# EAGLE schematic Tayloe Detector (EAGLE 9.1.2)
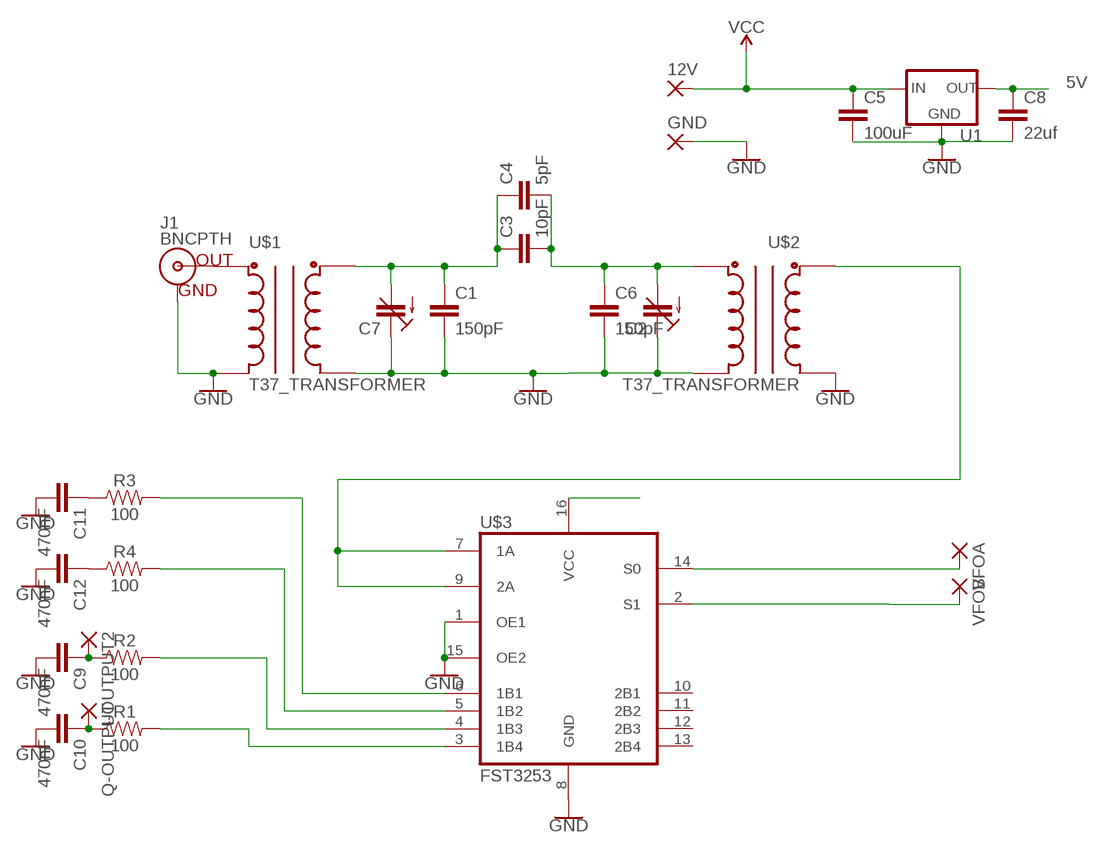
[diagram p0: schematic, sheet 1]

## Parts
12V  3,17/1,1  [3,17/1,1]
C1  150pF  C5/3.5  [C5B3.5]
C2  C-TRIMMTZ03  [CTRIMTZ03]
C3  10pF  C5/3.5  [C5B3.5]
C4  5pF  C5/3.5  [C5B3.5]
C5  100uF  C5/3.5  [C5B3.5]
C6  150pF  C5/3.5  [C5B3.5]
C7  C-TRIMMTZ03  [CTRIMTZ03]
C8  22uf  C5/3.5  [C5B3.5]
C9  470nF  C5/3.5  [C5B3.5]
C10  470nF  C5/3.5  [C5B3.5]
C11  470nF  C5/3.5  [C5B3.5]
C12  470nF  C5/3.5  [C5B3.5]
GND  3,17/1,1  [3,17/1,1]
I-OUTPUT2  3,17/1,1  [3,17/1,1]
J1  BNCPTH  [BNC]
Q-OUTPUT  3,17/1,1  [3,17/1,1]
R1  100  1KOHM-HORIZ-1/4W-1%  [AXIAL-0.3]
R2  100  1KOHM-HORIZ-1/4W-1%  [AXIAL-0.3]
R3  100  1KOHM-HORIZ-1/4W-1%  [AXIAL-0.3]
R4  100  1KOHM-HORIZ-1/4W-1%  [AXIAL-0.3]
U1  V_REG_78XXTO-92_UNTESTED  [TO-92]
U$1  T37_TRANSFORMER  [T37_TRANSFORMER]
U$2  T37_TRANSFORMER  [T37_TRANSFORMER]
U$3  FST3253  [SO16]
VFOA  3,17/1,1  [3,17/1,1]
VFOB  3,17/1,1  [3,17/1,1]

## Nets
5V: C8.1 U1.1(OUT) U$3.16(VCC)
GND: C1.2 C2.1(E) C5.2 C6.2 C7.1(E) C8.2 C9.2 C10.2 C11.2 C12.2 GND.1(P) J1.GND U1.2(GND) U$1.C1A U$1.C2A U$2.C1A U$2.C2A U$3.1(OE1) U$3.8(GND) U$3.15(OE2)
N$1: C1.1 C3.1 C4.1 C7.2(A) U$1.C2B
N$2: J1.S(OUT) U$1.C1B
N$3: C2.2(A) C3.2 C4.2 C6.1 U$2.C2B
N$4: U$2.C1B U$3.7(1A) U$3.9(2A)
N$5: R1.P$2 U$3.3(1B4)
N$6: C10.1 Q-OUTPUT.1(P) R1.P$1
N$9: C11.1 R3.P$1
N$10: C12.1 R4.P$1
N$11: R4.P$2 U$3.5(1B2)
N$12: C9.1 I-OUTPUT2.1(P) R2.P$1
N$13: R2.P$2 U$3.4(1B3)
N$14: R3.P$2 U$3.6(1B1)
N$15: U$3.14(S0) VFOA.1(P)
N$17: U$3.2(S1) VFOB.1(P)
VCC: 12V.1(P) C5.1 U1.3(IN)
Unconnected: U$3.10(2B1) U$3.11(2B2) U$3.12(2B3) U$3.13(2B4)

## Library data of the parts
12V GND I-OUTPUT2 Q-OUTPUT VFOA VFOB = wirepad:3,17/1,1: THROUGH-HOLE PAD
C1 C3-C6 C8-C12 = capacitor-wima:C: CAPACITOR naming: grid - package width
C2 C7 = resistor:C-TRIMM: Trimm capacitor
J1 = SparkFun-Connectors:BNC: BNC Right Angle Connector Mouser Part# 5227161 SparkFun Products: BNC Connector - Right Angle <https://www.sparkfun.com/products/10550>; PROD_ID: LPA-12729; SF_ID: PRT-10550
R1-R4 = SparkFun-Resistors:1KOHM: 1kΩ resistor A resistor is a passive two-terminal electrical component that implements electrical resistance as a circuit element. Resistors act to reduce current flow, and, at the same time, act to lower voltage levels within circuits. - Wikipedia; PROD_ID: RES-12182; VALUE: 1k
U1 = SparkFun-IC-Power:V_REG_78XX: Voltage Regulator Standard 78xx regulator. IGO (Input Ground Output). Spark Fun Electronics SKU : COM-00107
U$1 U$2 = toroid:T37_TRANSFORMER: Transformer wound on a T37 Toroid
U$3 = SparkFun-IC-Comms:FST3253: The Fairchild Switch FST3253 is a dual 4:1 high-speed CMOS TTL-compatible multiplexer/demultiplexer bus switch. The low on resistance of the switch allows inputs to be connected to outputs without adding propagation delay or generating additional ground bounce noise. When OE is LOW, S0 and S1 connect the A Port to the selected B Port output. When OE is HIGH, the switch is OPEN and a high-impedance state exists between the two

## Net classes
0 default: width 0.762 mm, drill 0.762 mm, clearance 0.508 mm